# Altium schematic sheet Power.SchDoc
size A4; SheetNumber: 2; SheetTotal: 7
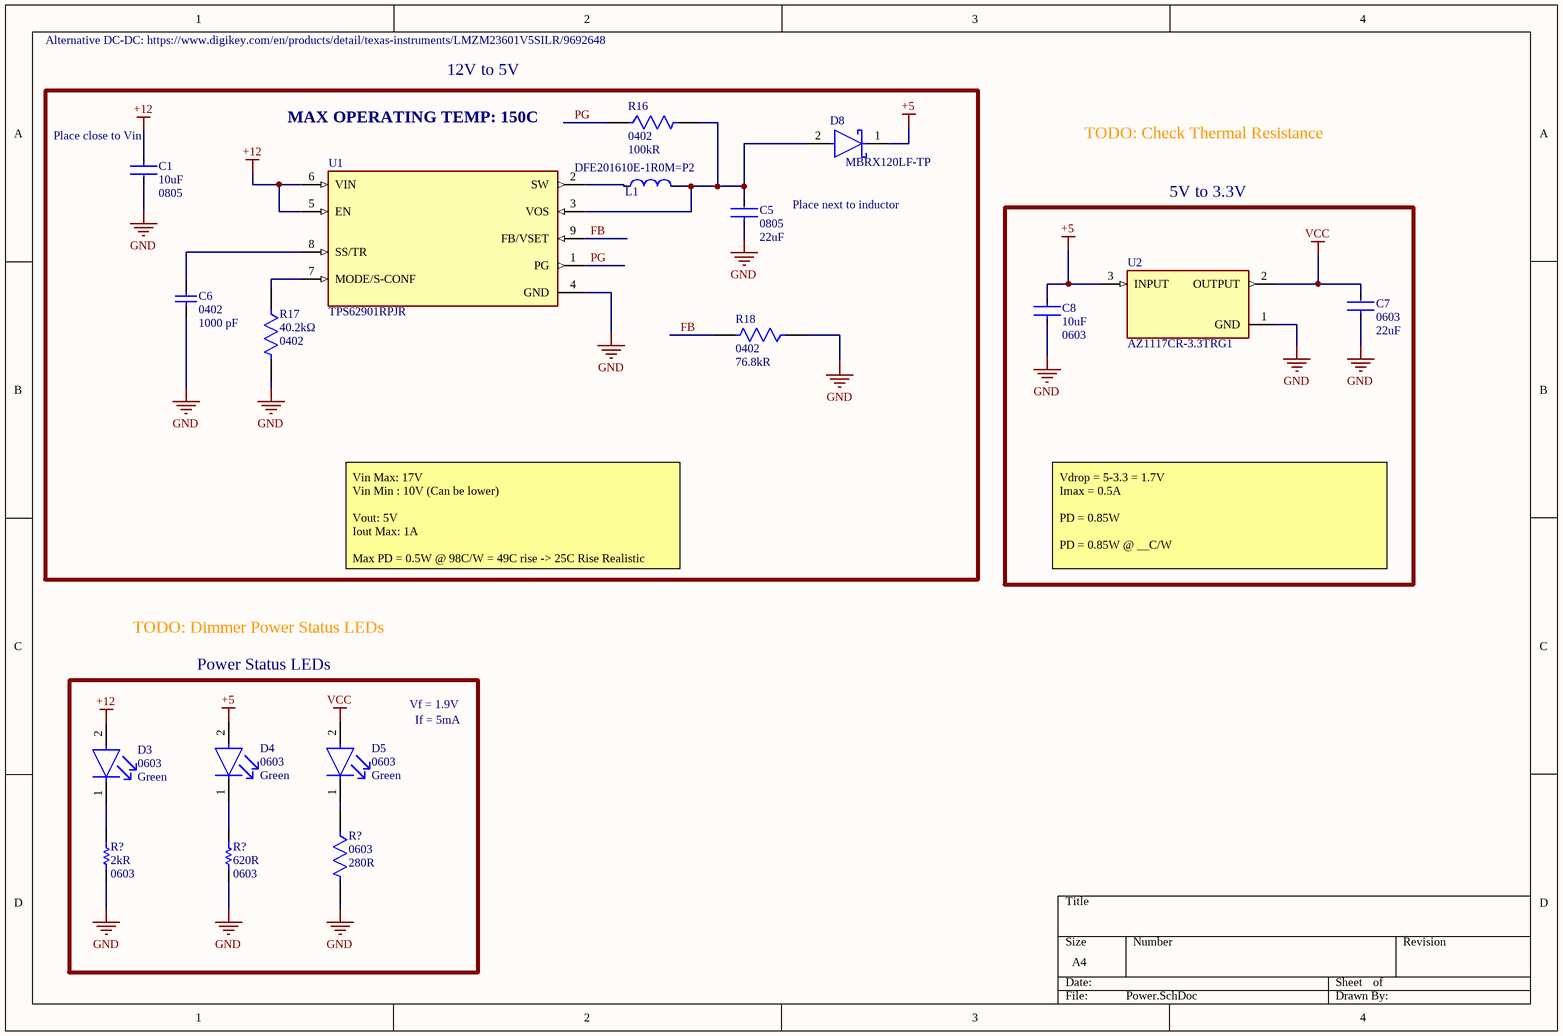
[diagram p0: Power.SchDoc]

## Parts
(Parts that share a designator on the sheet are numbered #1, #2 ... from top to bottom, then left to right.)
C1  Capacitance: 10uF  Case/Package: 0805  [FP-GRM21B-0_15-IPC_B]  (hidden comment: GRM21BR61E106KA73K)
C5  Case Code (Imperial): 0805  Capacitance: 22uF  [FP-GRM21B-0_2-e0_2_0_7-IPC_B]  (hidden comment: GRM21BD70J226ME44L)
C6  Package: 0402  Capacitance: 1000 pF  [CAPC1005X55X25ML05T10]  (hidden comment: GRM155R61A102KA01D)
C7  Case/Package: 0603  Capacitance: 22uF  [FP-GRM188-0_2-MFG]  (hidden comment: GRM188R60G226MEA0D)
C8  Capacitance: 10uF  Case/Package: 0603  [FP-CL10-IPC_C]  (hidden comment: CL10A106MQ8NNNC)
D3  Case Code (Imperial): 0603  Color: Green  [FP-LTST-C190KGKT-MFG]  (hidden comment: 12V)
D4  Case Code (Imperial): 0603  Color: Green  [FP-LTST-C190KGKT-MFG]  (hidden comment: 5V)
D5  Case Code (Imperial): 0603  Color: Green  [FP-LTST-C190KGKT-MFG]  (hidden comment: 3V3)
D8  MBRX120LF-TP  [FP-SOD-123-IPC_A]
L1  DFE201610E-1R0M=P2  [FP-DFE201610C-MFG]
R16  Case/Package: 0402  Resistance: 100kR  [FP-CRCW0402-e3-IPC_C]  (hidden comment: CRCW0402100KFKED)
R17  Resistance: 40.2kΩ  Case/Package: 0402  [FP-CRCW0402-Ce3-MFG]  (hidden comment: CRCW040240K2FKEDC)
R18  Case Code (Imperial): 0402  Resistance: 76.8kR  [FP-CRCW0402-e3-IPC_B]  (hidden comment: CRCW040276K8FKED)
R?#1  Case/Package: 0603  Resistance: 280R  [FP-RMCF0603-MFG]  (hidden comment: RMCF0603FT280R)
R?#2  Resistance: 2kR  Package: 0603  [RESC1608X55X30ML15T15]  (hidden comment: ERJ-3EKF2001V)
R?#3  Resistance: 620R  Package: 0603  [RESC1608X55X25ML10T15]  (hidden comment: RC0603FR-07620RL)
U1  TPS62901RPJR  [FP-RPJ0009A-MFG]
U2  AZ1117CR-3.3TRG1  [FP-SOT89-MFG]

## Blocks framed on the sheet
5V to 3.3V: C7 C8 U2
Power Status LEDs: D3-D5 R?#1-R?#3

## Nets
+5: C8.2 D4.2(A) D8.1(C) U2.3(INPUT)
+12: C1.1 D3.2(A) U1.5(EN) U1.6(VIN)
GND: C1.2 C5.1 C6.2 C7.1 C8.1 R17.2 R18.1 R?#1.2 R?#2.2 R?#3.2 U1.4(GND) U2.1(GND)
VCC: C7.2 D5.2(A) U2.2(OUTPUT)
FB: R18.2 U1.9(FB/VSET)
PG: R16.1 U1.1(PG)
NetC5_2: C5.2 D8.2(A) L1.2 R16.2 U1.3(VOS)
NetC6_1: C6.1 U1.8(SS/TR)
NetD3_1: D3.1(C) R?#2.1
NetD4_1: D4.1(C) R?#3.1
NetD5_1: D5.1(C) R?#1.1
NetL1_1: L1.1 U1.2(SW)
NetR17_1: R17.1 U1.7(MODE/S-CONF)

## Notes on the sheet
- Alternative DC-DC: https://www.digikey.com/en/products/detail/texas-instruments/LMZM23601V5SILR/9692648
- 12V to 5V
- (near C1) Place close to Vin
- MAX OPERATING TEMP: 150C
- TODO: Check Thermal Resistance
- Place next to inductor
- Vin Max: 17V
  Vin Min : 10V (Can be lower)
  Vout: 5V
  Iout Max: 1A
  Max PD = 0.5W @ 98C/W = 49C rise -> 25C Rise Realistic
- Vdrop = 5-3.3 = 1.7V
  Imax = 0.5A
  PD = 0.85W
  PD = 0.85W @ __C/W
- TODO: Dimmer Power Status LEDs
- Vf = 1.9V
- If = 5mA

## Library data of the parts
C1 = CMP-06035-004844-1: Chip Multilayer Ceramic Capacitors for General Purpose, 0805, 10uF, X5R, 15%, 10%, 25V; Max Operating Temperature: 85°C; Min Operating Temperature: -55°C; Package Quantity: 10000; Weight: 0.000335oz; Voltage Rating: 25V; Tolerance: 10%; Voltage Rating (DC): 25V; Mount: Surface Mount; Length: 0.079inch; Packaging: Tape and Reel; Dielectric: X5R; Width: 0.049inch; Thickness: 0.055inch
C5 = CMP-06035-048447-1: Chip Multilayer Ceramic Capacitors for General Purpose, 0805, 22uF, X7T, +22%/-33%, 20%, 6.3V; Mount: Surface Mount; Packaging: Tape and Reel; Voltage Rating: 6.3V; Height: 1.25mm; Voltage Rating (DC): 6.3V; Case/Package: 0805; Weight: 0.000335oz; Dielectric: X7T; Length: 0.079inch; Width: 1.25mm; Package Quantity: 3000; Thickness: 0.057inch; Tolerance: 20%; Min Operating Temperature: -55°C; Case Code (Metric): 2012; Termination: SMD/SMT; Max Operating Temperature: 125°C; Resistor Type: Ceramic
C6 = CMP-2008-04555-1: Manufacturer: Murata; Part Number: GRM155R61A102KA01D
C7 = CMP-2006-02788-2: Chip Multilayer Ceramic Capacitors for General Purpose, 0603, 22uF, X5R, 15%, 20%, 4V; Package Quantity: 4000; Lead Free: Lead Free; Material: Ceramic; Height: 0.8mm; Length: 1.6mm; REACH SVHC: No SVHC; Voltage Rating: 4V; Depth: 0.8mm; Case Code (Metric): 1608; Voltage: 4V; Dielectric: X5R; Width: 0.8mm; Max Operating Temperature: 85°C; Tolerance: 20%; Packaging: Tape and Reel; Case Code (Imperial): 0603; Voltage Rating (DC): 4V; Thickness: 0.035inch; Mount: Surface Mount; Min Operating Temperature: -55°C; Radiation Hardening: No; Termination: SMD/SMT
C8 = CMP-13271-001938-1: Cap Ceramic 10uF 6.3V X5R ±20% Pad SMD 0603 +85°C T/R; Contact Plating: Tin; Height: 0.8mm; Width: 0.031inch; Min Operating Temperature: -55°C; Dielectric: X5R; Voltage Rating: 6.3V; Package Quantity: 1; Radiation Hardening: No; Packaging: Tape and Reel; Max Operating Temperature: 85°C; Voltage: 6.3V; Thickness: 0.035inch; Mount: Surface Mount; Case Code (Imperial): 0603; Case Code (Metric): 1608; Depth: 0.8mm; Tolerance: 20%; Length: 1.6mm
D3 D5 = CMP-2000-05197-2: LED GREEN CLEAR CHIP SMD; Test Current: 20mA; Power Rating: 75mW; Forward Voltage: 2V; Wavelength: 574nm; Number of LEDs: 1; Reverse Voltage: 5V; Dominant Wavelength: 571nm; Lens Style: Diffused; Luminous Intensity: 35mcd; Forward Current: 30mA; Viewing Angle: 130°; Lens Color: Colorless; Width: 0.8mm; Case Code (Metric): 1608; Number of Pins: 2; Radiation Hardening: No; Package Quantity: 1; Lead Free: Lead Free; Lens Transparency: Clear; Depth: 0.8mm; Power Dissipation: 75mW; Mount: Surface Mount; Max Operating Temperature: 85°C; Case/Package: 0603; Height: 0.8mm; Illumination Color: Green; Length: 1.6mm; Packaging: Tape and Reel; Number of Elements: 1; Min Operating Temperature: -55°C
D4 = CMP-2000-05197-2: LED GREEN CLEAR CHIP SMD; Test Current: 20mA; Power Rating: 75mW; Forward Voltage: 2V; Wavelength: 574nm; Number of LEDs: 1; Dominant Wavelength: 571nm; Lens Style: Diffused; Luminous Intensity: 35mcd; Forward Current: 30mA; Viewing Angle: 130°; Lens Color: Colorless; Width: 0.8mm; Case Code (Metric): 1608; Number of Pins: 2; Radiation Hardening: No; Package Quantity: 1; Lead Free: Lead Free; Lens Transparency: Clear; Depth: 0.8mm; Power Dissipation: 75mW; Reverse Voltage: 5V; Mount: Surface Mount; Max Operating Temperature: 85°C; Case/Package: 0603; Height: 0.8mm; Illumination Color: Green; Length: 1.6mm; Packaging: Tape and Reel; Number of Elements: 1; Min Operating Temperature: -55°C
D8 = CMP-56206-000012-1: DIODE SCHOTTKY 20V 1A SOD123; Max Power Dissipation: 556mW; Forward Voltage: 360mV; Peak Non-Repetitive Surge Current: 12A; Element Configuration: Single; Max Reverse Voltage (DC): 20V; Lead Free: Lead Free; Max Operating Temperature: 125°C; Radiation Hardening: No; Mount: Surface Mount; Number of Pins: 2; Average Rectified Current: 1A; Min Operating Temperature: -65°C; Max Repetitive Reverse Voltage (Vrrm): 20V; RoHS Compliant: Yes; Package Quantity: 1; Max Forward Surge Current (Ifsm): 12A; Packaging: Tape and Reel; Max Surge Current: 12A; Forward Current: 1A
L1 = CMP-06042-015199-1: Shielded Wirewound Inductor 1uH 20% 2700mA 0.057Ω 0806 (2016)
R16 = CMP-2002-08123-3: RES Thick Film, 100kΩ, 1%, 0.063W, 100ppm/°C, 0402; Power Rating: 63mW; Voltage Rating (DC): 50V; Lead Free: Lead Free; Height: 0.35mm; Contact Plating: Tin; Min Operating Temperature: -55°C; Package Quantity: 10000; Temperature Coefficient: 100ppm/°C; Number of Terminations: 2; Packaging: Tape and Reel; Max Power Dissipation: 63mW; Case Code (Metric): 1005; Mount: Surface Mount; Width: 0.02inch; Termination: SMD/SMT; Length: 1mm; Number of Pins: 2; Weight: 2.3E-05oz; Radiation Hardening: No; Tolerance: 1%; Military Standard: Not; Features: Automotive AEC-Q200; Depth: 0.5mm; Composition: Thick Film; Max Operating Temperature: 155°C; Voltage Rating: 50V; Case Code (Imperial): 0402
R17 = CMP-00030-23798208-3: CRCW040240K2FKEDC SMD Chip Resistor, 40.2 kOhm, ± 1%, 63 mW, 0402 [1005 Metric], Thick Film, General Purpose; Voltage Rating: 50V; Temperature Coefficient: 100ppm/°C; Power Rating: 63mW; NexarPartId: 23798208; Schedule B: 8533210045, 8533210045; Composition: Thick Film; RoHS: Compliant; Max Operating Temperature: 155°C; Height: 350µm; Number of Pins: 2; Tolerance: 1%; Lead Free: Lead Free; Min Operating Temperature: -55°C
R18 = CMP-2002-00214-2: RES Thick Film, 76.8kΩ, 1%, 0.063W, 100ppm/°C, 0402; Voltage Rating (DC): 50V; Max Power Dissipation: 63mW; Width: 0.5mm; Contact Plating: Tin; Case Code (Metric): 1005; Weight: 2.3E-05oz; Depth: 0.5mm; Height: 0.016inch; Termination: SMD/SMT; Military Standard: Not; Length: 1mm; Case/Package: 0402; Max Operating Temperature: 155°C; Radiation Hardening: No; Lead Free: Lead Free; Tolerance: 1%; Features: Automotive AEC-Q200; Min Operating Temperature: -55°C; Temperature Coefficient: 100ppm/°C; Power Rating: 63mW; Number of Terminations: 2; Voltage Rating: 50V; Package Quantity: 10; Packaging: Tape and Reel; Composition: Thick Film
R?#1 = CMP-26527-006784-1: 280Ω ±1% 0.1W 0603 Thick Film Chip Resistor AEC-Q200 compliant; Max Power Dissipation: 100mW; Temperature Coefficient: 100ppm/°C; RoHS Compliant: Yes; Height: 0.022inch; Resistor Type: Thick Film; Case Code (Metric): 1608; Radiation Hardening: No; Contact Plating: Tin; Series: RMCF; Features: Automotive AEC-Q200; Number of Terminations: 2; Tolerance: 1%; Packaging: Tape and Reel; Max Operating Temperature: 155°C; Min Operating Temperature: -55°C; Length: 0.061inch; Lead Free: Lead Free; Width: 0.031inch; Mount: Surface Mount; Case Code (Imperial): 0603
R?#2 = CMP-2000-00317-1: Manufacturer: Panasonic; Part Number: ERJ-3EKF2001V
R?#3 = CMP-2000-04103-1: Manufacturer: Yageo; Part Number: RC0603FR-07620RL
U1 = CMP-04918-000584-1: 3-V TO 17-V, 1-A, HIGH-EFFICIENC
U2 = CMP-12756-000007-1: IC REG LINEAR 3.3V 800MA SOT89; Manufacturer: Diodes Inc.; Nominal Supply Current: 4mA; Output Type: Fixed; Accuracy Percentage: 1%; Max Junction Temp: +125°C; Max Supply Voltage: 15V; Number Of Outputs: 1; Output Current: 1.35A; Dropout Voltage: 1.2V; Device Class L1: Integrated Circuits (ICs); ComponentLink2URL: https://www.diodes.com/assets/Datasheets/AZ1117C.pdf; Temperature Range High: +125°C; Octopart: https://octopart.com/az1117cr-3.3trg1-diodes+inc.-30954805; Output Voltage: 3.3V; Automotive: No; RoHS: TRUE; Temperature Range Low: -20°C; Package: SOT89; Height: 1.6mm; Mouser Description: DiodesZetex AZ1117CR-3.3TRG1, LDO Regulator, 800mA, 3.3 V, ±1% 3-Pin, SOT-89; Manufacturer Part Number: AZ1117CR-3.3TRG1; ComponentLink2Description: Datasheet; Device Class L2: Power Management ICs; Lead Free: Yes; Device Class L3: Voltage Regulators - Linear; Category: IC; Temperature: -20°C to +125°C; Footprint Url: https://www.diodes.com/assets/Package-Files/SOT89.pdf; Digikey Description: IC REG LINEAR 3.3V 800MA SOT89